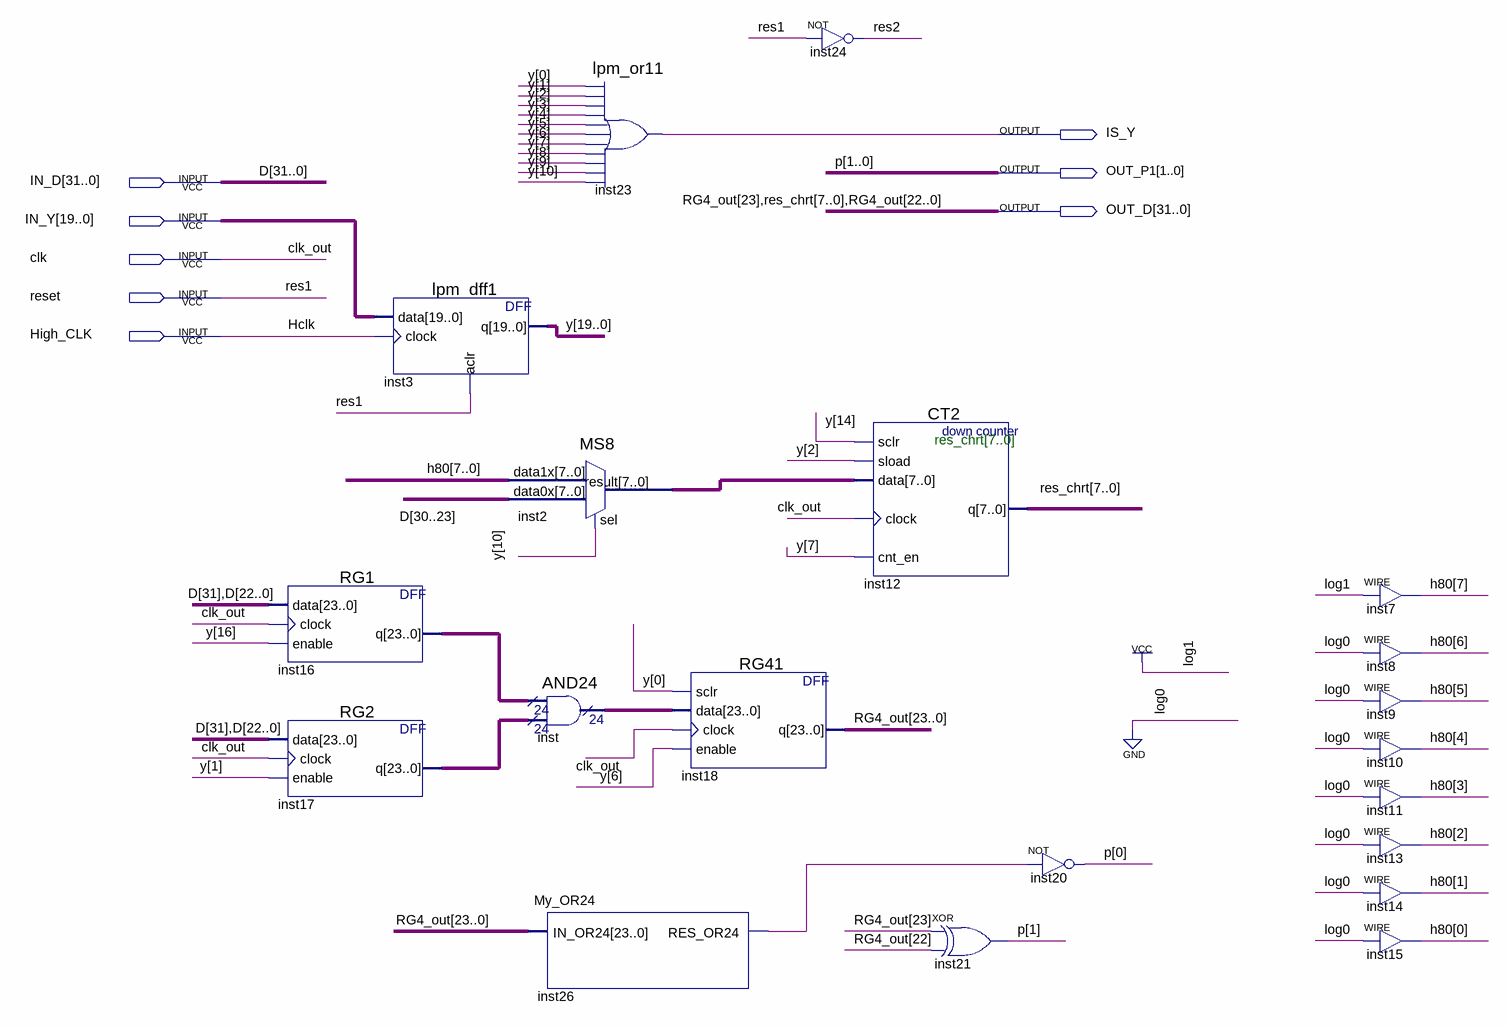
[diagram p0: schematic sheet]
// Quartus schematic My_NAND_24.bdf as structural Verilog: 20 symbols, 8 pins
module My_NAND_24 (
  input  [31:0] IN_D,
  input  [19:0] IN_Y,
  input  clk,
  input  reset,
  input  High_CLK,
  output IS_Y,
  output [1:0] OUT_P1,
  output [31:0] OUT_D
);

  wire inst26_res_or24, res2;
  wire [7:0] h80, inst2_result;
  wire [19:0] y;
  wire [23:0] inst16_q, inst17_q, inst_result;

  RG1 inst16 (.data({IN_D[31], IN_D[22:0]}), .clock(clk), .enable(y[16]), .q(inst16_q));
  RG2 inst17 (.data({IN_D[31], IN_D[22:0]}), .clock(clk), .enable(y[1]), .q(inst17_q));
  lpm_dff1 inst3 (.data(IN_Y), .clock(High_CLK), .aclr(reset), .q(y));
  MS8 inst2 (.data1x(h80), .data0x(IN_D[30:23]), .sel(y[10]), .result(inst2_result));
  lpm_or11 inst23 (
    .data0(y[0]), .data1(y[1]), .data2(y[2]), .data3(y[3]), .data4(y[4]), .data5(y[5]), .data6(y[6]),
    .data7(y[7]), .data8(y[8]), .data9(y[9]), .data10(y[10]), .result(IS_Y));
  AND24 inst (.data0x(inst16_q), .data1x(inst17_q), .result(inst_result));
  My_OR24 inst26 (.IN_OR24({OUT_D[31], OUT_D[22:0]}), .RES_OR24(inst26_res_or24));
  RG41 inst18 (.sclr(y[0]), .data(inst_result), .clock(clk), .enable(y[6]), .q({OUT_D[31], OUT_D[22:0]}));
  not inst24 (res2, reset);
  CT2 inst12 (.sclr(y[14]), .sload(y[2]), .data(inst2_result), .clock(clk), .cnt_en(y[7]), .q(OUT_D[30:23]));
  xor inst21 (OUT_P1[1], OUT_D[31], OUT_D[22]);
  not inst20 (OUT_P1[0], inst26_res_or24);
  assign h80[7] = 1'b1;  // WIRE inst7
  assign h80[6] = 1'b0;  // WIRE inst8
  assign h80[5] = 1'b0;  // WIRE inst9
  assign h80[4] = 1'b0;  // WIRE inst10
  assign h80[3] = 1'b0;  // WIRE inst11
  assign h80[2] = 1'b0;  // WIRE inst13
  assign h80[1] = 1'b0;  // WIRE inst14
  assign h80[0] = 1'b0;  // WIRE inst15

  // Other names for the same wires on the sheet: clk_out = clk; D[31:0] = IN_D; Hclk = High_CLK; p[1:0] = OUT_P1;
  //   res1 = reset; res_chrt[7:0] = OUT_D[30:23]; RG4_out[23:0] = {OUT_D[31], OUT_D[22:0]}

  // Notes on the sheet:
  //   res_chrt[7..0]
endmodule
